# EAGLE schematic main (EAGLE 5.06)
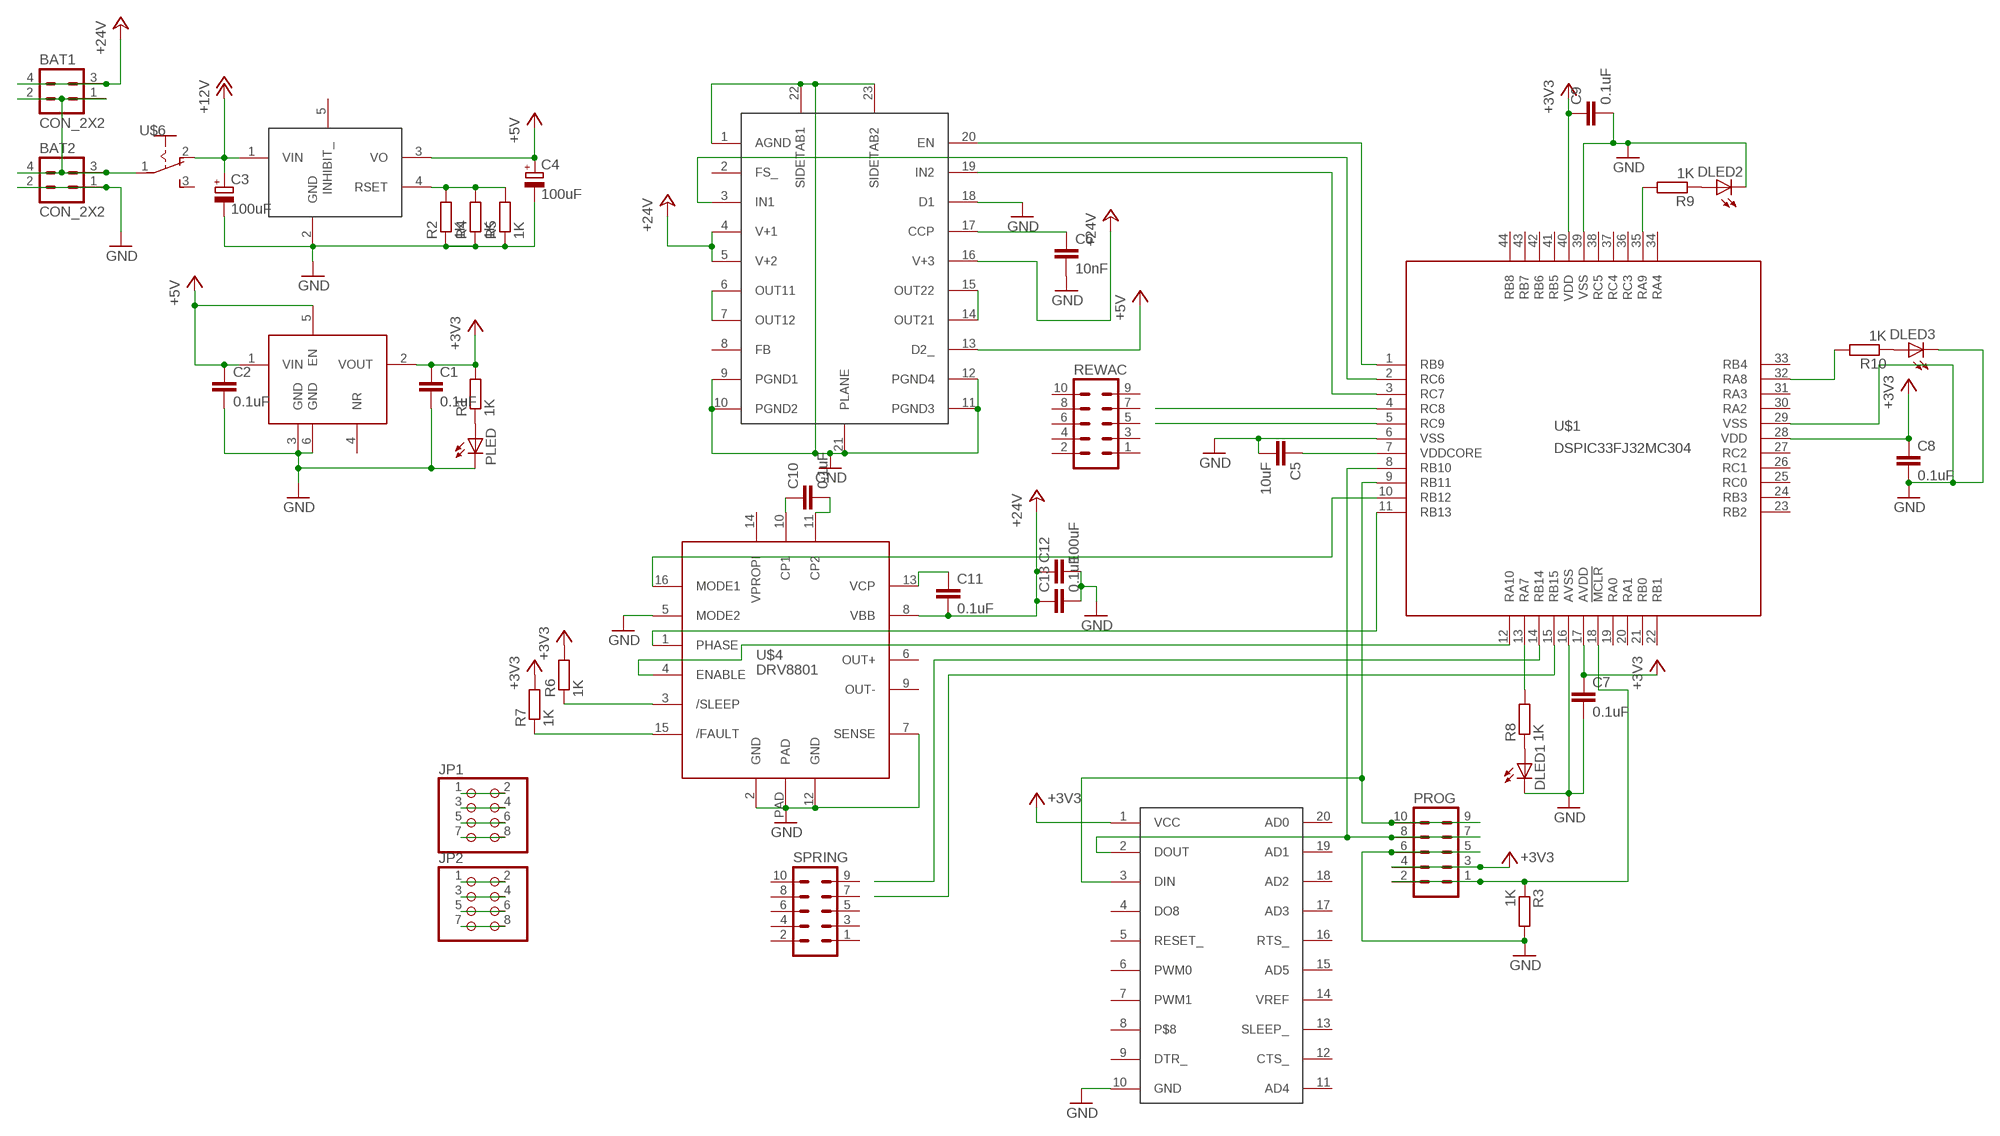
[diagram p0: schematic, sheet 1]

## Parts
BAT1  CON_2X2  [HEADER_2X2]
BAT2  CON_2X2  [HEADER_2X2]
C1  0.1uF  C-EUC0805  [C0805]
C2  0.1uF  C-EUC0805  [C0805]
C3  100uF  CPOL-EU153CLV-0605  [153CLV-0605]
C4  100uF  CPOL-EU153CLV-0605  [153CLV-0605]
C5  10uF  C-EUC0805  [C0805]
C6  10nF  C-EUC0805  [C0805]
C7  0.1uF  C-EUC0805  [C0805]
C8  0.1uF  C-EUC0805  [C0805]
C9  0.1uF  C-EUC0805  [C0805]
C10  0.1uF  C-EUC0805  [C0805]
C11  0.1uF  C-EUC0805  [C0805]
C12  100uF  C-EUC0805  [C0805]
C13  0.1uF  C-EUC0805  [C0805]
DLED1  LEDCHIPLED_0805  [CHIPLED_0805]
DLED2  LEDCHIPLED_0805  [CHIPLED_0805]
DLED3  LEDCHIPLED_0805  [CHIPLED_0805]
JP1  PINHD-2X4  [2X04]
JP2  PINHD-2X4  [2X04]
PLED  LEDCHIPLED_0805  [CHIPLED_0805]
PROG  ML10  [ML10]
R1  1K  R-EU_R0805  [R0805]
R2  1K  R-EU_R0805  [R0805]
R3  1K  R-EU_R0805  [R0805]
R4  1K  R-EU_R0805  [R0805]
R5  1K  R-EU_R0805  [R0805]
R6  1K  R-EU_R0805  [R0805]
R7  1K  R-EU_R0805  [R0805]
R8  1K  R-EU_R0805  [R0805]
R9  1K  R-EU_R0805  [R0805]
R10  1K  R-EU_R0805  [R0805]
REWAC  ML10  [ML10]
SPRING  ML10  [ML10]
U$1  DSPIC33FJ32MC304  [TQFP44]
U$2  REG104  [SOT223-5]
U$3  PTH08080W  [PTH08080W]
U$4  DRV8801  [QFN16]
U$5  MC33887  [HSOP-MC3387]
U$6  SWITCH_SPDT  [SWITCH-3P]
XBEE  XBEE  [XBEE]

## Nets
+3V3: C1.1 C7.1 C8.1 C9.1 PROG.3 PROG.4 R1.2 R6.2 R7.2 U$1.17(AVDD) U$1.28(VDD) U$1.40(VDD) U$2.2(VOUT) XBEE.1(VCC)
+5V: C2.1 C4.+ U$2.1(VIN) U$2.5(EN) U$3.3(VO) U$5.13(D2_)
+12V: C3.+ U$3.1(VIN) U$6.2(O)
+24V: BAT1.3 BAT1.4 C11.2 C12.1 C13.1 U$4.8(VBB) U$5.4(V+1) U$5.5(V+2) U$5.16(V+3)
GND: BAT2.1 BAT2.2 C1.2 C2.2 C3.- C4.- C5.2 C6.2 C7.2 C8.2 C9.2 C12.2 C13.2 DLED1.C DLED2.C DLED3.C PLED.C PROG.5 PROG.6 R2.1 R3.2 R4.1 R5.1 U$1.6(VSS) U$1.16(AVSS) U$1.29(VSS) U$1.39(VSS) U$2.3(GND) U$2.6(GND) U$3.2(GND) U$4.2(GND) U$4.5(MODE2) U$4.7(SENSE) U$4.12(GND) U$4.PAD U$5.1(AGND) U$5.9(PGND1) U$5.10(PGND2) U$5.11(PGND3) U$5.12(PGND4) U$5.18(D1) U$5.21(PLANE) U$5.22(SIDETAB1) U$5.23(SIDETAB2) XBEE.10(GND)
N$1: PLED.A R1.1
N$2: PROG.1 PROG.2 R3.1 U$1.18(!MCLR)
N$3: BAT1.1 BAT1.2 BAT2.3 BAT2.4 U$6.1(P)
N$4: U$1.14(RB14)
N$5: U$1.1(RB9) U$5.20(EN)
N$6: R2.2 R4.2 R5.2 U$3.4(RSET)
N$7: PROG.7 PROG.8 U$1.8(RB10) XBEE.2(DOUT)
N$8: PROG.9 PROG.10 U$1.9(RB11) XBEE.3(DIN)
N$9: U$1.2(RC6) U$5.3(IN1)
N$10: C5.1 U$1.7(VDDCORE)
N$11: U$1.3(RC7) U$5.19(IN2)
N$12: C6.1 U$5.17(CCP)
N$13: U$1.15(RB15)
N$14: C10.1 U$4.10(CP1)
N$15: C10.2 U$4.11(CP2)
N$16: C11.1 U$4.13(VCP)
N$17: U$5.6(OUT11) U$5.7(OUT12)
N$18: U$5.14(OUT21) U$5.15(OUT22)
N$20: R7.1 U$4.15(/FAULT)
N$21: R6.1 U$4.3(/SLEEP)
N$22: U$1.12(RA10) U$4.4(ENABLE)
N$24: U$1.10(RB12) U$4.16(MODE1)
N$25: U$1.4(RC8)
N$26: U$1.5(RC9)
N$27: DLED1.A R8.1
N$28: R8.2 U$1.13(RA7)
N$29: DLED2.A R9.1
N$30: DLED3.A R10.1
N$31: R9.2 U$1.35(RA9)
N$32: U$1.11(RB13) U$4.1(PHASE)
N$34: R10.2 U$1.32(RA8)
N$35: JP1.1 JP1.2
N$36: JP1.3 JP1.4
N$37: JP1.5 JP1.6
N$38: JP1.7 JP1.8
N$39: JP2.1 JP2.2
N$40: JP2.3 JP2.4
N$41: JP2.5 JP2.6
N$42: JP2.7 JP2.8
Unconnected: REWAC.1 REWAC.2 REWAC.3 REWAC.4 REWAC.5 REWAC.6 REWAC.7 REWAC.8 REWAC.9 REWAC.10 SPRING.1 SPRING.2 SPRING.3 SPRING.4 SPRING.5 SPRING.6 SPRING.7 SPRING.8 SPRING.9 SPRING.10 U$1.19(RA0) U$1.20(RA1) U$1.21(RB0) U$1.22(RB1) U$1.23(RB2) U$1.24(RB3) U$1.25(RC0) U$1.26(RC1) U$1.27(RC2) U$1.30(RA2) U$1.31(RA3) U$1.33(RB4) U$1.34(RA4) U$1.36(RC3) U$1.37(RC4) U$1.38(RC5) U$1.41(RB5) U$1.42(RB6) U$1.43(RB7) U$1.44(RB8) U$2.4(NR) U$3.5(INHIBIT_) U$4.6(OUT+) U$4.9(OUT-) U$4.14(VPROPI) U$5.2(FS_) U$5.8(FB) U$6.3(S) XBEE.4(DO8) XBEE.5(RESET_) XBEE.6(PWM0) XBEE.7(PWM1) XBEE.8 XBEE.9(DTR_) XBEE.11(AD4) XBEE.12(CTS_) XBEE.13(SLEEP_) XBEE.14(VREF) XBEE.15(AD5) XBEE.16(RTS_) XBEE.17(AD3) XBEE.18(AD2) XBEE.19(AD1) XBEE.20(AD0)

## Library data of the parts
BAT1 BAT2 = igeek:CON_2X2: Relimate 2x2 connector
C1 C2 C5-C13 = rcl:C-EU: CAPACITOR, European symbol
C3 C4 = rcl:CPOL-EU: POLARIZED CAPACITOR, European symbol
DLED1-DLED3 PLED = led:LED: LED OSRAM: - CHIPLED LG R971, LG N971, LY N971, LG Q971, LY Q971, LO R971, LY R971 LH N974, LH R974 LS Q976, LO Q976, LY Q976 LO Q996 - Hyper CHIPLED LW Q18S LB Q993, LB Q99A, LB R99A - SideLED LS A670, LO A670, LY A670, LG A670, LP A670 LB A673, LV A673, LT A673, LW A673 LH A674 LY A675 LS A676, LA A676, LO A676, LY A676, LW A676 LS A679, LY A679, LG A679 - Hyper Micro SIDELED® LS Y876, LA Y876, LO Y876, LY Y876 LT Y87S - SmartLED LW L88C, LW L88S LB L89C, LB L89S, LG L890 LS L89K, LO L89K, LY L89K LS L896, LA L896, LO L896, LY L896 - TOPLED LS T670, LO T670, LY T670, LG T670, LP T670 LSG T670, LSP T670, LSY T670, LOP T670, LYG T670 LG T671, LOG T671, LSG T671 LB T673, LV T673, LT T673, LW T673 LH T674 LS T676, LA T676, LO T676, LY T676, LB T676, LH T676, LSB T676, LW T676 LB T67C, LV T67C, LT T67C, LS T67K, LO T67K, LY T67K, LW E67C LS E67B, LA E67B, LO E67B, LY E67B, LB E67C, LV E67C, LT E67C LW T67C LS T679, LY T679, LG T679 LS T770, LO T770, LY T770, LG T770, LP T770 LB T773, LV T773, LT T773, LW T773 LH T774 LS E675, LA E675, LY E675, LS T675 LS T776, LA T776, LO T776, LY T776, LB T776 LHGB T686 LT T68C, LB T68C - Hyper Mini TOPLED® LB M676 - Mini TOPLED Santana® LG M470 LS M47K, LO M47K, LY M47K Source: http://www.osram.convergy.de LUXEON: - LUMILED® LXK2-PW12-R00, LXK2-PW12-S00, LXK2-PW14-U00, LXK2-PW14-V00 LXK2-PM12-R00, LXK2-PM12-S00, LXK2-PM14-U00 LXK2-PE12-Q00, LXK2-PE12-R00, LXK2-PE12-S00, LXK2-PE14-T00, LXK2-PE14-U00 LXK2-PB12-K00, LXK2-PB12-L00, LXK2-PB12-M00, LXK2-PB14-N00, LXK2-PB14-P00, LXK2-PB14-Q00 LXK2-PR12-L00, LXK2-PR12-M00, LXK2-PR14-Q00, LXK2-PR14-R00 LXK2-PD12-Q00, LXK2-PD12-R00, LXK2-PD12-S00 LXK2-PH12-R00, LXK2-PH12-S00 LXK2-PL12-P00, LXK2-PL12-Q00, LXK2-PL12-R00 Source: www.luxeon.com KINGBRIGHT: KA-3528ASYC Source: www.kingbright.com
JP1 JP2 = pinhead:PINHD-2X4: PIN HEADER
PROG REWAC SPRING = con-harting-ml:ML10: HARTING
R1-R10 = rcl:R-EU_: RESISTOR, European symbol
U$1 = igeek:DSPIC33FJ32MC304: dsPIC33FJ32MC304
U$2 = igeek:REG104: REG104 DMOS 1A Low-Dropout Regulator
U$3 = slom:PTH08080W
U$4 = igeek:DRV8801: TI DRV8801 DMOS FULL-BRIDGE MOTOR DRIVER
U$5 = slom:MC33887
U$6 = igeek:SWITCH_SPDT: SPST Switch
XBEE = slom:XBEE